# Altium schematic sheet MB_CPU_100m_ethernet.SchDoc
size A4
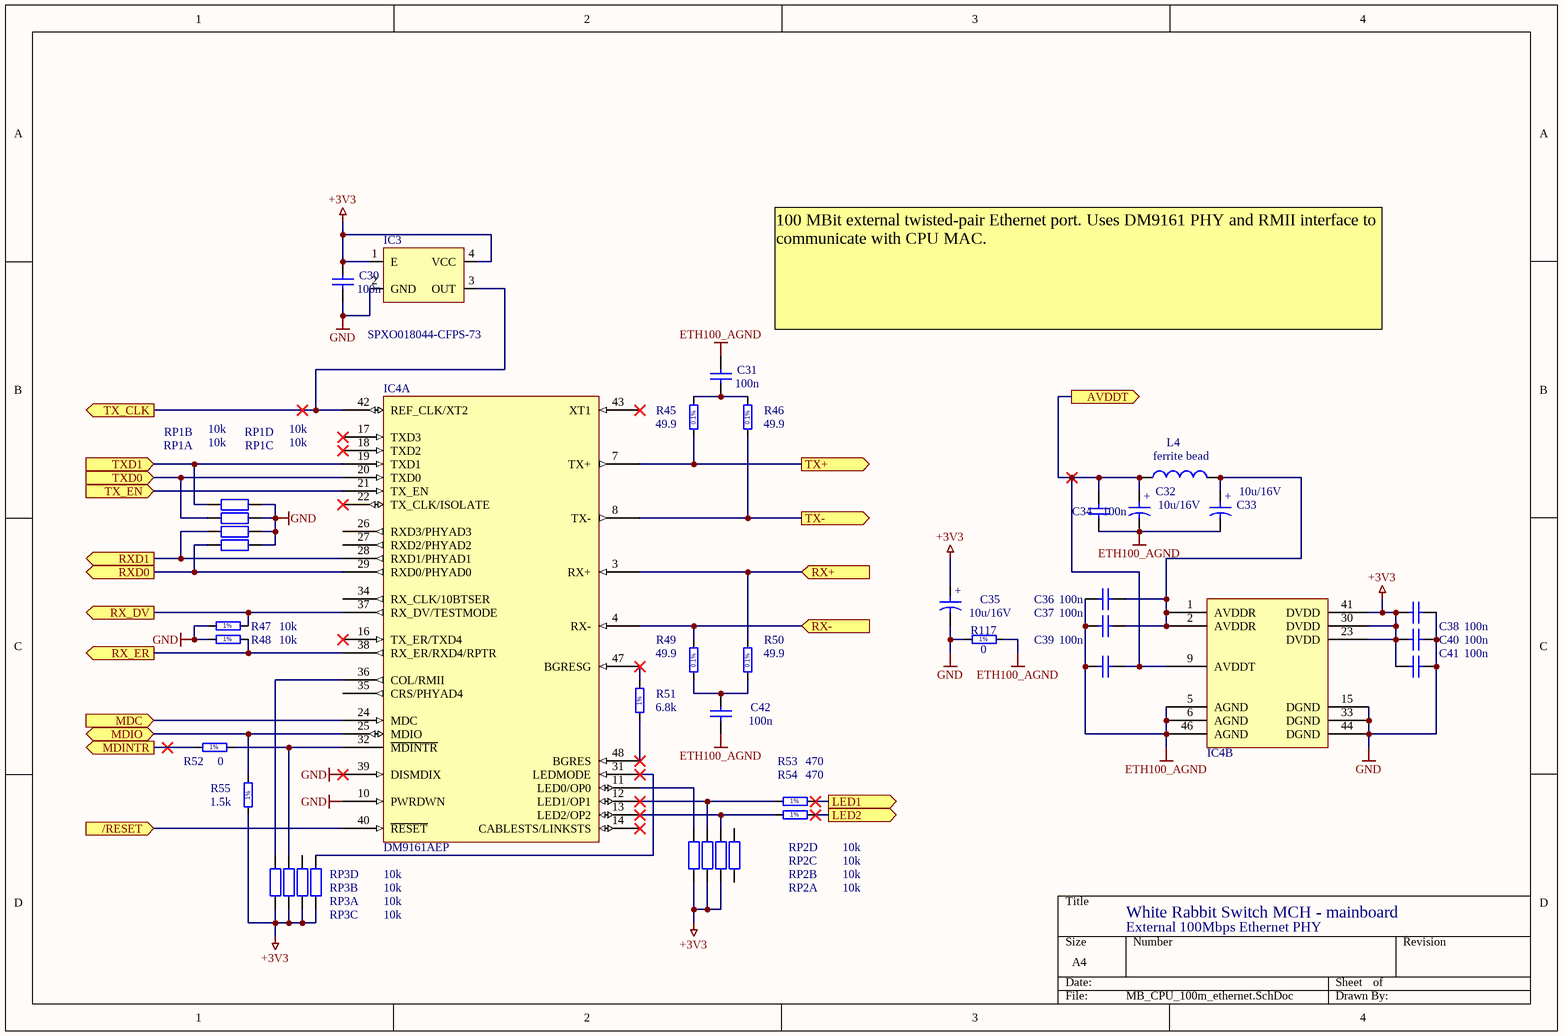
[diagram p0: MB_CPU_100m_ethernet.SchDoc]

## Parts
C30  100n  [CAPC1608X87N]
C31  100n  [CAPC1608X87N]
C32  10u/16V  [CAPMP3216X180N]
C33  10u/16V  [CAPMP3216X180N]
C34  100n  [CAPC1005X55N]
C35  10u/16V  [CAPMP3216X180N]
C36  100n  [CAPC1005X55N]
C37  100n  [CAPC1005X55N]
C38  100n  [CAPC1005X55N]
C39  100n  [CAPC1005X55N]
C40  100n  [CAPC1005X55N]
C41  100n  [CAPC1005X55N]
C42  100n  [CAPC1608X87N]
IC3  value SPXO018044-CFPS-73  [CFPS_73]  (hidden comment: CFPS-73)
IC4  DM9161AEP  [LQFP48l]  (parts A,B of 2)
L4  value ferrite bead  [INDC1608-0603]  (hidden comment: Inductor)
R45  49.9  [RESC1608X55N]
R46  49.9  [RESC1608X55N]
R47  10k  [RESC1005X40N]
R48  10k  [RESC1005X40N]
R49  49.9  [RESC1608X55N]
R50  49.9  [RESC1608X55N]
R51  6.8k  [RESC1608X55N]
R52  0  [RESC1005X40N]
R53  470  [RESC1005X40N]
R54  470  [RESC1005X40N]
R55  1.5k  [RESC1005X40N]
R117  0  [RESC3216X65N]
RP1  value 10k  [YC124]  (hidden comment: RES_PACK)  (parts A,B,C,D of 4)
RP2  value 10k  [YC124]  (hidden comment: RES_PACK)  (parts A,B,C,D of 4)
RP3  value 10k  [YC124]  (hidden comment: RES_PACK)  (parts A,B,C,D of 4)

## Ports
/RESET (in), AVDDT (out), LED1 (out), LED2 (out), MDC (in), MDINTR (out), MDIO (bidir), RX+ (in), RX- (in), RX_DV (out), RX_ER (out), RXD0 (out), RXD1 (out), TX+ (out), TX- (out), TX_CLK (out), TX_EN (in), TXD0 (in), TXD1 (in)

## Nets
+3V3: C30.2 C35.1 C38.1 C40.1 C41.1 IC3.1(E) IC3.4(VCC) IC4.23(DVDD) IC4.30(DVDD) IC4.41(DVDD) R55.1 RP2.1(A) RP2.2(A) RP2.3(A) RP3.1(A) RP3.2(A) RP3.3(A) RP3.4(A)
ETH100_AGND: C31.2 C32.2 C33.2 C34.1 C36.2 C37.2 C39.2 C42.1 IC4.5(AGND) IC4.6(AGND) IC4.46(AGND) R117.2
GND: C30.1 C35.2 C38.2 C40.2 C41.2 IC3.2(GND) IC4.10(PWRDWN) IC4.15(DGND) IC4.33(DGND) IC4.39(DISMDIX) IC4.44(DGND) R47.1 R48.1 R117.1 RP1.5(B) RP1.6(B) RP1.7(B) RP1.8(B)
/RESET: IC4.40(~{RESET}) ; port /RESET
AVDDT: C32.1 C34.2 C39.1 IC4.9(AVDDT) L4.1 ; port AVDDT
LED1: R54.2 ; port LED1
LED2: R53.2 ; port LED2
MDC: IC4.24(MDC) ; port MDC
MDINTR: R52.1 ; port MDINTR
MDIO: IC4.25(MDIO) R55.2 ; port MDIO
RX+: IC4.3(RX+) R50.2 ; port RX+
RX-: IC4.4(RX-) R49.2 ; port RX-
RX_DV: IC4.37(RX_DV/TESTMODE) R47.2 ; port RX_DV
RX_ER: IC4.38(RX_ER/RXD4/RPTR) R48.2 ; port RX_ER
RXD0: IC4.29(RXD0/PHYAD0) RP1.1(A) ; port RXD0
RXD1: IC4.28(RXD1/PHYAD1) RP1.2(A) ; port RXD1
TX+: IC4.7(TX+) R45.1 ; port TX+
TX-: IC4.8(TX-) R46.1 ; port TX-
TX_CLK: IC3.3(OUT) IC4.42(REF_CLK/XT2) ; port TX_CLK
TX_EN: IC4.21(TX_EN) ; port TX_EN
TXD0: IC4.20(TXD0) RP1.4(A) ; port TXD0
TXD1: IC4.19(TXD1) RP1.3(A) ; port TXD1
NetC31_1: C31.1 R45.2 R46.2
NetC33_1: C33.1 C36.1 C37.1 IC4.1(AVDDR) IC4.2(AVDDR) L4.2
NetC42_2: C42.2 R49.1 R50.1
NetIC4_11: IC4.11(LED0/OP0) RP2.8(B)
NetIC4_12: IC4.12(LED1/OP1) R54.1 RP2.7(B)
NetIC4_13: IC4.13(LED2/OP2) R53.1 RP2.6(B)
NetIC4_31: IC4.31(LEDMODE) RP3.8(B)
NetIC4_32: IC4.32(~{MDINTR}) R52.2 RP3.7(B)
NetIC4_36: IC4.36(COL/RMII) RP3.5(B)
NetIC4_47: IC4.47(BGRESG) R51.2
NetIC4_48: IC4.48(BGRES) R51.1

Not connected (* = marked no-connect by the designer): IC4 14(CABLESTS/LINKSTS)* 16(TX_ER/TXD4)* 17(TXD3)* 18(TXD2)* 22(TX_CLK/ISOLATE)* 26(RXD3/PHYAD3) 27(RXD2/PHYAD2) 34(RX_CLK/10BTSER) 35(CRS/PHYAD4) 43(XT1)*; RP2 4(A) 5(B); RP3 6(B)

## Notes on the sheet
- !
- 100 MBit external twisted-pair Ethernet port. Uses DM9161 PHY and RMII interface to communicate with CPU MAC.
- White Rabbit Switch MCH - mainboard
- External 100Mbps Ethernet PHY
- (in symbol CTE3216-18_10UF_10V_10%_LESR1800) +
- (in symbol R0402_0R_JUMPER) 1%
- (in symbol R0402_1K5_1%_0.0625W_100PPM) 1%
- (in symbol R0402_10K_1%_0.0625W_100PPM) 1%
- (in symbol R0402_470R_1%_0.0625W_100PPM) 1%
- (in symbol R0603_6K8_1%_0.1W_100PPM) 1%
- (in symbol R0603_49R9_0.1%_0.063W_10PPM) 0.1%
- (in symbol R1206_0R_JUMPER) 1%

## Library data of the parts
C30 C31 C42 = CC0603_100NF_50V_10%_X7R: Non-polarised capacitor; Part Description: SMD Multilayer Chip Ceramic Capacitor; Manufacturer: GENERIC; Manufacturer1 Part Number: 223858615649; Manufacturer1 Datasheet: \\cern.ch\dfs\Applications\Altium\Datasheets\CC0603_X7R_PHYCOMP.pdf; Value: 100nF; Voltage: 50V; TC: X7R; Tolerance: ±10%; Table: Capacitors SMD; Part Number: CC0603_100NF_50V_10%_X7R; Component Kind: Standard; Component Type: Standard; Designator: Capacitor - non polarized; Library Reference: Capacitor - non polarized; Pin Count: 2; Status: Preferred; Manufacturer Part Number: CC0603_100NF_50V_10%_X7R; Case: 0603; Mounted: Yes; Socket: No; SMD: Yes; Manufacturer1 Example: PHYCOMP; Manufacturer1 ComponentHeight: 0.87mm; HelpURL: \\cern.ch\dfs\Applications\Altium\Datasheets\CC0603_X7R_PHYCOMP.pdf; Author: CERN DEM JLC; CreateDate: 12/3/2007; LatestRevisionDate: 12/3/2007
C32 C33 C35 = CTE3216-18_10UF_10V_10%_LESR1800: Polarised capacitor; Part Description: Low ESR 1R8 Solid Tantalum Chip Capacitor; Manufacturer: GENERIC; Manufacturer1 Part Number: TPSA106K010R1800; Manufacturer1 Datasheet: \\cern.ch\dfs\Applications\Altium\Datasheets\CTE-LESR_AVX_TPS.pdf; Value: 10uF; Voltage: 10V; Tolerance: ±10%; Table: Capacitors SMD; Part Number: CTE3216-18_10UF_10V_10%_LESR1800; Component Kind: Standard; Component Type: Standard; Designator: Capacitor - polarized; Library Reference: Capacitor - polarized; Pin Count: 2; Status: Preferred; Manufacturer Part Number: CTE3216-18_10UF_10V_10%_LESR1800; Case: A; Mounted: Yes; Socket: No; SMD: Yes; Manufacturer1 Example: AVX; Manufacturer1 ComponentHeight: 1.8mm; HelpURL: \\cern.ch\dfs\Applications\Altium\Datasheets\CTE-LESR_AVX_TPS.pdf; Author: CERN DEM JLC; CreateDate: 5/5/2008; LatestRevisionDate: 1/20/2009
C34 C36-C41 = CC0402_100NF_16V_10%_X7R: Non-polarised capacitor; Part Description: SMD Multilayer Chip Ceramic Capacitor; Manufacturer: GENERIC; Manufacturer1 Part Number: 223878715649; Manufacturer1 Datasheet: \\cern.ch\dfs\Applications\Altium\Datasheets\CC0402_X7R_PHYCOMP.pdf; Value: 100nF; Voltage: 16V; TC: X7R; Tolerance: ±10%; Table: Capacitors SMD; Part Number: CC0402_100NF_16V_10%_X7R; Component Kind: Standard; Component Type: Standard; Designator: Capacitor - non polarized; Library Reference: Capacitor - non polarized; Pin Count: 2; Status: Not Recommended; Manufacturer Part Number: CC0402_100NF_16V_10%_X7R; Case: 0402; Mounted: Yes; Socket: No; SMD: Yes; Manufacturer1 Example: PHYCOMP; Manufacturer1 ComponentHeight: 0.55mm; HelpURL: \\cern.ch\dfs\Applications\Altium\Datasheets\CC0402_X7R_PHYCOMP.pdf; Author: CERN DEM JLC; CreateDate: 12/3/2007; LatestRevisionDate: 12/3/2007
IC3 = OSC_CFPS-73: SMD oscillator 3.3V (Elfa); RefId: 1652547; Supplier: Farnell
IC4 = IFC_DM9161AE: Davicom 100Mbps ethernet PHY; DEV: QFP48_01; BOI: LQFP48; Right: 160; Bottom: 450; Value: DM9161AEP; FAB: DAVICOM; RoHS: YES
L4 = Inductor: Ferrite bead; Published: 8-Jun-2000; Revision: July-2002: Re-released for DXP Platform.; Publisher: Altium Limited
R45 R46 R49 R50 = R0603_49R9_0.1%_0.063W_10PPM: Resistor - 0.1%; Part Description: Thin Film Chip Resistor; Manufacturer: GENERIC; Manufacturer1 Part Number: RN73C1J49R9BTDF; Manufacturer1 Datasheet: \\cern.ch\dfs\Applications\Altium\Datasheets\R0603_Tyco_RN73.pdf; Value: 49R9; Power: 0.063W; TC: ±10ppm; Table: Resistors SMD; Part Number: R0603_49R9_0.1%_0.063W_10PPM; Component Kind: Standard; Component Type: Standard; Designator: Resistor - 0.1%; Library Reference: Resistor - 0.1%; Pin Count: 2; Status: Not recommended; Tolerance: ±0.1%; Manufacturer Part Number: R0603_49R9_0.1%_0.063W_10PPM; Case: 0603; Mounted: Yes; Socket: No; SMD: Yes; Manufacturer1 Example: TYCO HOLSWORTHY; Manufacturer1 ComponentHeight: 0.5mm; HelpURL: \\cern.ch\dfs\Applications\Altium\Datasheets\R0603_Tyco_RN73.pdf; Author: CERN DEM JLC; CreateDate: 12/3/2007; LatestRevisionDate: 3/13/2008
R47 R48 = R0402_10K_1%_0.0625W_100PPM: Resistor - 1%; Part Description: General Purpose Thick Film Chip Resistor; Manufacturer: GENERIC; Manufacturer1 Part Number: 232270671003; Manufacturer1 Datasheet: \\cern.ch\dfs\Applications\Altium\Datasheets\R0402_Phycomp_RC0402.pdf; TC: ±100ppm/°C; Table: Resistors SMD; Part Number: R0402_10K_1%_0.0625W_100PPM; Component Kind: Standard; Component Type: Standard; Designator: Resistor - 1%; Library Reference: Resistor - 1%; Pin Count: 2; Value: 10k; Status: Not recommended; Power: 0.0625W; Tolerance: ±1%; Manufacturer Part Number: R0402_10K_1%_0.0625W_100PPM; Case: 0402; Mounted: Yes; Socket: No; SMD: Yes; Manufacturer1 Example: PHYCOMP; Manufacturer1 ComponentHeight: 0.4mm; HelpURL: \\cern.ch\dfs\Applications\Altium\Datasheets\R0402_Phycomp_RC0402.pdf; Author: CERN DEM JLC; CreateDate: 12/3/2007; LatestRevisionDate: 3/13/2008
R51 = R0603_6K8_1%_0.1W_100PPM: Resistor - 1%; Part Description: General Purpose Thick Film Chip Resistor; Manufacturer: GENERIC; Manufacturer1 Part Number: NRC06F6801TRF; Manufacturer1 Datasheet: \\cern.ch\dfs\Applications\Altium\Datasheets\R0603_NIC_NRC.pdf; Value: 6k8; Power: 0.1W; TC: ±100ppm/°C; Table: Resistors SMD; Part Number: R0603_6K8_1%_0.1W_100PPM; Component Kind: Standard; Component Type: Standard; Designator: Resistor - 1%; Library Reference: Resistor - 1%; Pin Count: 2; Status: Preferred; Tolerance: ±1%; Manufacturer Part Number: R0603_6K8_1%_0.1W_100PPM; Case: 0603; Mounted: Yes; Socket: No; SMD: Yes; Manufacturer1 Example: NIC COMPONENT; Manufacturer1 ComponentHeight: 0.55mm; HelpURL: \\cern.ch\dfs\Applications\Altium\Datasheets\R0603_NIC_NRC.pdf; Author: CERN DEM JLC; CreateDate: 12/3/2007; LatestRevisionDate: 3/13/2008
R52 = R0402_0R_JUMPER: Resistor - 1%; Part Description: 1A (0.05R Max DC Resistance) Zero Ohm Jumper; Manufacturer: GENERIC; Manufacturer1 Part Number: 232270591001; Manufacturer1 Datasheet: \\cern.ch\dfs\Applications\Altium\Datasheets\R0402_Phycomp_RC0402.pdf; Table: Resistors SMD; Part Number: R0402_0R_JUMPER; Component Kind: Standard; Component Type: Standard; Designator: Resistor - 1%; Library Reference: Resistor - 1%; Pin Count: 2; Value: 0; Status: Not recommended; Manufacturer Part Number: R0402_0R_JUMPER; Case: 0402; Mounted: Yes; Socket: No; SMD: Yes; Manufacturer1 Example: PHYCOMP; Manufacturer1 ComponentHeight: 0.4mm; HelpURL: \\cern.ch\dfs\Applications\Altium\Datasheets\R0402_Phycomp_RC0402.pdf; Author: CERN DEM JLC; CreateDate: 12/3/2007; LatestRevisionDate: 3/13/2008
R53 R54 = R0402_470R_1%_0.0625W_100PPM: Resistor - 1%; Part Description: General Purpose Thick Film Chip Resistor; Manufacturer: GENERIC; Manufacturer1 Part Number: 232270674701; Manufacturer1 Datasheet: \\cern.ch\dfs\Applications\Altium\Datasheets\R0402_Phycomp_RC0402.pdf; TC: ±100ppm/°C; Table: Resistors SMD; Part Number: R0402_470R_1%_0.0625W_100PPM; Component Kind: Standard; Component Type: Standard; Designator: Resistor - 1%; Library Reference: Resistor - 1%; Pin Count: 2; Value: 470; Status: Not recommended; Power: 0.0625W; Tolerance: ±1%; Manufacturer Part Number: R0402_470R_1%_0.0625W_100PPM; Case: 0402; Mounted: Yes; Socket: No; SMD: Yes; Manufacturer1 Example: PHYCOMP; Manufacturer1 ComponentHeight: 0.4mm; HelpURL: \\cern.ch\dfs\Applications\Altium\Datasheets\R0402_Phycomp_RC0402.pdf; Author: CERN DEM JLC; CreateDate: 12/3/2007; LatestRevisionDate: 3/13/2008
R55 = R0402_1K5_1%_0.0625W_100PPM: Resistor - 1%; Part Description: General Purpose Thick Film Chip Resistor; Manufacturer: GENERIC; Manufacturer1 Part Number: 232270671502; Manufacturer1 Datasheet: \\cern.ch\dfs\Applications\Altium\Datasheets\R0402_Phycomp_RC0402.pdf; Value: 1k5; TC: ±100ppm/°C; Table: Resistors SMD; Part Number: R0402_1K5_1%_0.0625W_100PPM; Component Kind: Standard; Component Type: Standard; Designator: Resistor - 1%; Library Reference: Resistor - 1%; Pin Count: 2; Status: Not recommended; Power: 0.0625W; Tolerance: ±1%; Manufacturer Part Number: R0402_1K5_1%_0.0625W_100PPM; Case: 0402; Mounted: Yes; Socket: No; SMD: Yes; Manufacturer1 Example: PHYCOMP; Manufacturer1 ComponentHeight: 0.4mm; HelpURL: \\cern.ch\dfs\Applications\Altium\Datasheets\R0402_Phycomp_RC0402.pdf; Author: CERN DEM JLC; CreateDate: 12/3/2007; LatestRevisionDate: 3/13/2008
R117 = R1206_0R_JUMPER: Resistor - 1%; Part Description: 2A (0.05R Max DC Resistance) Zero Ohm Jumper; Manufacturer: GENERIC; Manufacturer1 Part Number: NRC12Z0; Manufacturer1 Datasheet: \\cern.ch\dfs\Applications\Altium\Datasheets\R1206_NIC_NRC.pdf; Table: Resistors SMD; Part Number: R1206_0R_JUMPER; Component Kind: Standard; Component Type: Standard; Designator: Resistor - 1%; Library Reference: Resistor - 1%; Pin Count: 2; Value: 0; Status: Preferred; Manufacturer Part Number: R1206_0R_JUMPER; Case: 1206; Mounted: Yes; Socket: No; SMD: Yes; Manufacturer1 Example: NIC COMPONENT; Manufacturer1 ComponentHeight: 0.65mm; HelpURL: \\cern.ch\dfs\Applications\Altium\Datasheets\R1206_NIC_NRC.pdf; Author: CERN DEM JLC; CreateDate: 2007-12-03; LatestRevisionDate: 2008-03-13
RP1-RP3 = Res_Pack4_10k_YC124: 4-resistor pack; RefId: AVX  CRB2A4 series; Supplier: Farnell